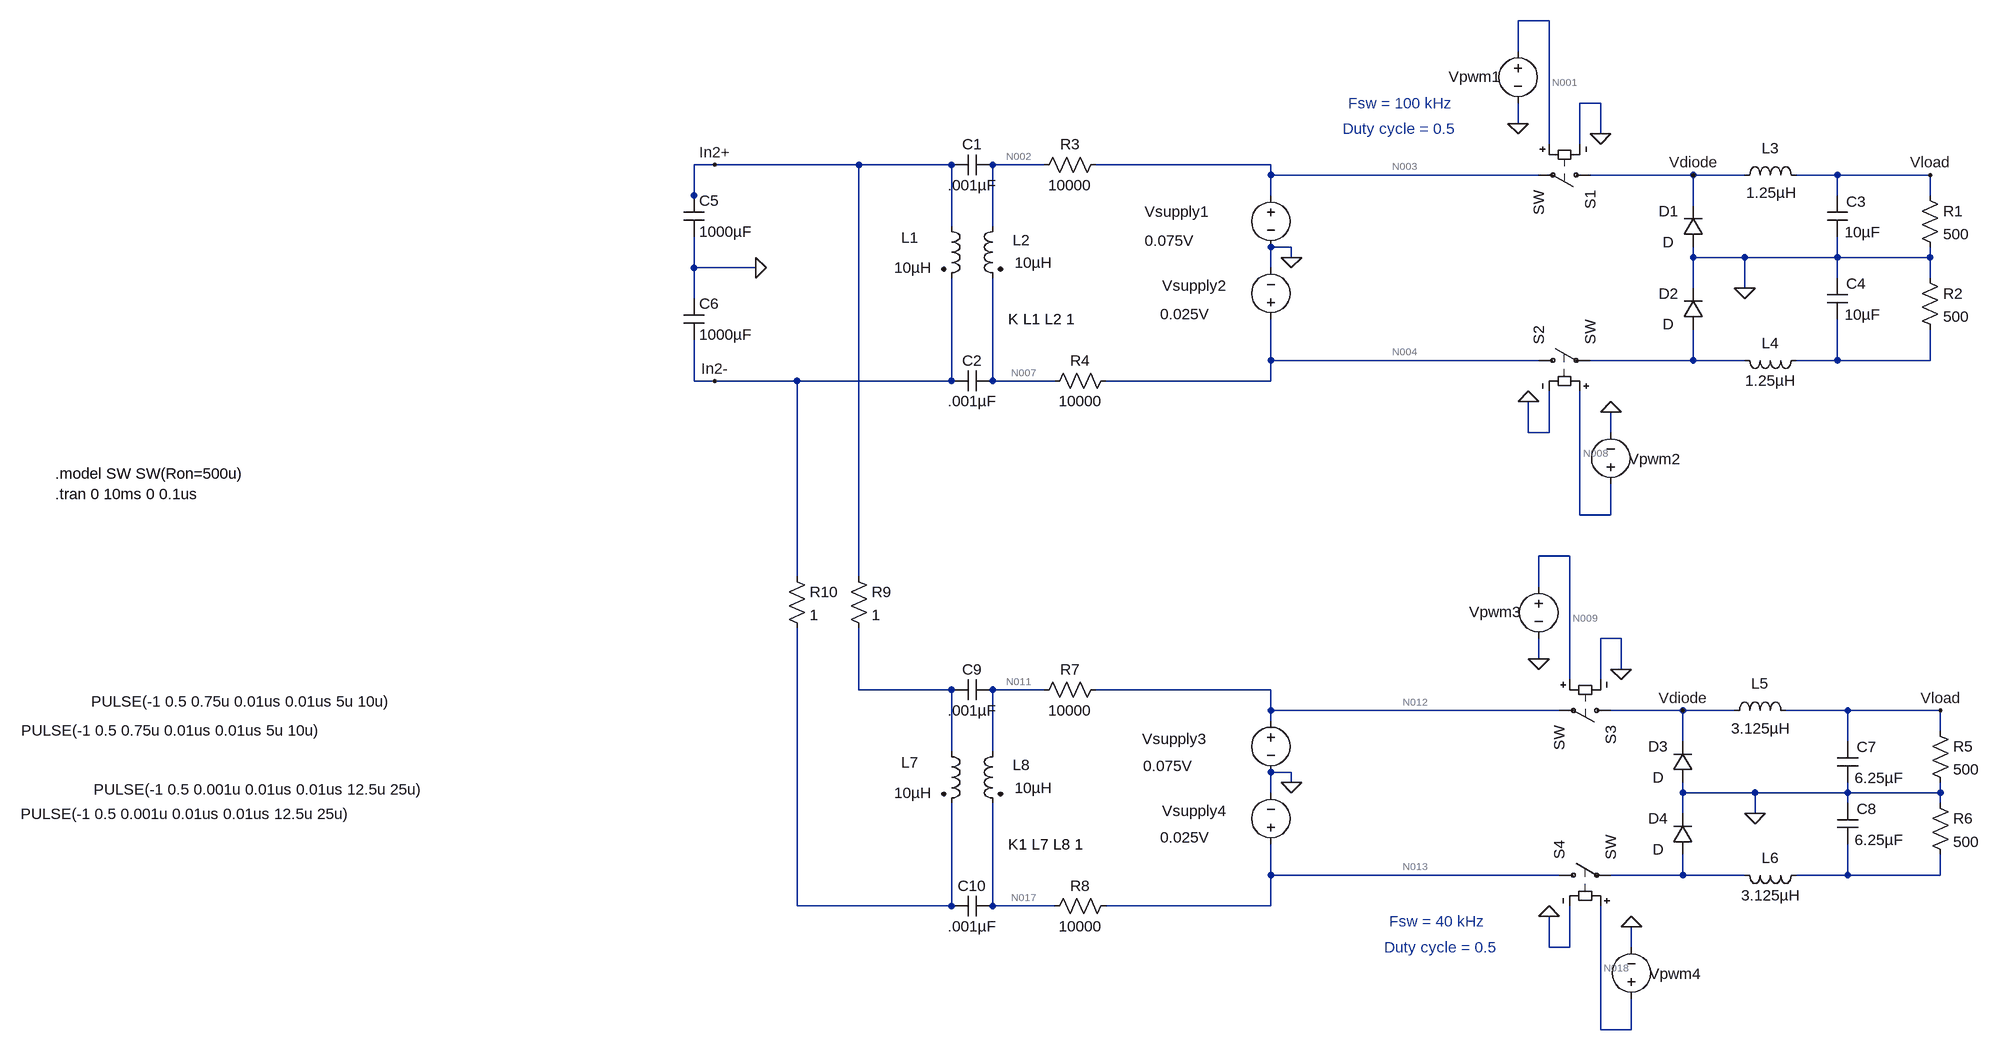
[diagram p0: schematic AC Power Flow ver2.3 (CM-DM Model) .asc]
AC Power Flow ver2.3 (CM-DM Model) .asc, the LTspice schematic file:
Version 4
SHEET 1 3264 1352
WIRE 1472 -320 1424 -320
WIRE 1424 -272 1424 -320
WIRE 1552 -192 1520 -192
WIRE 1424 -160 1424 -192
WIRE 1552 -144 1552 -192
WIRE 1472 -128 1472 -320
WIRE 1520 -128 1520 -192
WIRE 176 -96 144 -96
WIRE 400 -96 176 -96
WIRE 544 -96 400 -96
WIRE 688 -96 608 -96
WIRE 1040 -96 768 -96
WIRE 1040 -80 1040 -96
WIRE 1456 -80 1040 -80
WIRE 1696 -80 1536 -80
WIRE 1776 -80 1696 -80
WIRE 1920 -80 1856 -80
WIRE 2064 -80 1920 -80
WIRE 144 -48 144 -96
WIRE 1040 -48 1040 -80
WIRE 1920 -48 1920 -80
WIRE 2064 -48 2064 -80
WIRE 144 -32 144 -48
WIRE 1696 -32 1696 -80
WIRE 544 0 544 -96
WIRE 608 0 608 -96
WIRE 1072 32 1040 32
WIRE 1072 48 1072 32
WIRE 1696 48 1696 32
WIRE 1776 48 1696 48
WIRE 1920 48 1920 16
WIRE 1920 48 1776 48
WIRE 2064 48 2064 32
WIRE 2064 48 1920 48
WIRE 144 64 144 16
WIRE 240 64 144 64
WIRE 1040 64 1040 32
WIRE 1920 80 1920 48
WIRE 2064 80 2064 48
WIRE 1696 96 1696 48
WIRE 1776 96 1776 48
WIRE 144 112 144 64
WIRE 1040 208 1040 144
WIRE 1456 208 1040 208
WIRE 1696 208 1696 160
WIRE 1696 208 1536 208
WIRE 1776 208 1696 208
WIRE 1920 208 1920 144
WIRE 1920 208 1856 208
WIRE 2064 208 2064 160
WIRE 2064 208 1920 208
WIRE 144 240 144 176
WIRE 176 240 144 240
WIRE 304 240 176 240
WIRE 544 240 544 80
WIRE 544 240 304 240
WIRE 608 240 608 80
WIRE 704 240 608 240
WIRE 1040 240 1040 208
WIRE 1040 240 784 240
WIRE 1440 320 1440 272
WIRE 1472 320 1472 256
WIRE 1472 320 1440 320
WIRE 1568 320 1568 288
WIRE 1520 448 1520 256
WIRE 1568 448 1568 400
WIRE 1568 448 1520 448
WIRE 1504 512 1456 512
WIRE 304 544 304 240
WIRE 400 544 400 -96
WIRE 1456 560 1456 512
WIRE 1584 640 1552 640
WIRE 1456 672 1456 640
WIRE 1584 688 1584 640
WIRE 1504 704 1504 512
WIRE 1552 704 1552 640
WIRE 400 720 400 624
WIRE 544 720 400 720
WIRE 688 720 608 720
WIRE 1040 720 768 720
WIRE 1040 752 1040 720
WIRE 1488 752 1040 752
WIRE 1680 752 1568 752
WIRE 1760 752 1680 752
WIRE 1936 752 1840 752
WIRE 2080 752 1936 752
WIRE 1040 768 1040 752
WIRE 2080 784 2080 752
WIRE 1680 800 1680 752
WIRE 1936 800 1936 752
WIRE 544 816 544 720
WIRE 608 816 608 720
WIRE 1072 848 1040 848
WIRE 1072 864 1072 848
WIRE 1040 880 1040 848
WIRE 1680 880 1680 864
WIRE 1792 880 1680 880
WIRE 1936 880 1936 864
WIRE 1936 880 1792 880
WIRE 2080 880 2080 864
WIRE 2080 880 1936 880
WIRE 1936 896 1936 880
WIRE 2080 896 2080 880
WIRE 1680 912 1680 880
WIRE 1792 912 1792 880
WIRE 1040 1008 1040 960
WIRE 1488 1008 1040 1008
WIRE 1680 1008 1680 976
WIRE 1680 1008 1568 1008
WIRE 1776 1008 1680 1008
WIRE 1936 1008 1936 960
WIRE 1936 1008 1856 1008
WIRE 2080 1008 2080 976
WIRE 2080 1008 1936 1008
WIRE 304 1056 304 624
WIRE 544 1056 544 896
WIRE 544 1056 304 1056
WIRE 608 1056 608 896
WIRE 704 1056 608 1056
WIRE 1040 1056 1040 1008
WIRE 1040 1056 784 1056
WIRE 1472 1120 1472 1072
WIRE 1504 1120 1504 1056
WIRE 1504 1120 1472 1120
WIRE 1600 1120 1600 1088
WIRE 1552 1248 1552 1056
WIRE 1600 1248 1600 1200
WIRE 1600 1248 1552 1248
FLAG 240 64 0
FLAG 176 -96 In2+
FLAG 176 240 In2-
FLAG 1072 48 0
FLAG 1552 -144 0
FLAG 2064 -80 Vload
FLAG 1424 -160 0
FLAG 1696 -80 Vdiode
FLAG 1440 272 0
FLAG 1568 288 0
FLAG 1776 96 0
FLAG 1584 688 0
FLAG 2080 752 Vload
FLAG 1456 672 0
FLAG 1680 752 Vdiode
FLAG 1472 1072 0
FLAG 1600 1088 0
FLAG 1792 912 0
FLAG 1072 864 0
SYMBOL ind2 528 -16 R0
WINDOW 0 -62 33 Left 2
WINDOW 3 -73 80 Left 2
SYMATTR InstName L1
SYMATTR Value 10µH
SYMATTR Type ind
SYMBOL ind2 624 -16 M0
WINDOW 0 -42 37 Left 2
WINDOW 3 -76 72 Left 2
SYMATTR InstName L2
SYMATTR Value 10µH
SYMATTR Type ind
SYMBOL cap 608 -112 R90
WINDOW 0 0 32 VBottom 2
WINDOW 3 32 32 VTop 2
SYMATTR InstName C1
SYMATTR Value .001µF
SYMBOL cap 608 224 R90
WINDOW 0 0 32 VBottom 2
WINDOW 3 32 32 VTop 2
SYMATTR InstName C2
SYMATTR Value .001µF
SYMBOL sw 1552 -80 R90
SYMATTR InstName S1
SYMBOL voltage 1040 -64 R0
WINDOW 3 -196 86 Left 2
WINDOW 123 0 0 Left 2
WINDOW 39 0 0 Left 2
WINDOW 0 -196 41 Left 2
SYMATTR Value 0.075V
SYMATTR InstName Vsupply1
SYMBOL res 2048 -64 R0
SYMATTR InstName R1
SYMATTR Value 500
SYMBOL voltage 1424 -288 R0
WINDOW 3 -1752 1026 Right 2
WINDOW 123 0 0 Left 2
WINDOW 39 0 0 Left 2
WINDOW 0 -108 55 Left 2
SYMATTR Value PULSE(-1 0.5 0.75u 0.01us 0.01us 5u 10u)
SYMATTR InstName Vpwm1
SYMBOL diode 1712 32 R180
WINDOW 0 39 56 Left 2
WINDOW 3 46 8 Left 2
SYMATTR InstName D1
SYMBOL ind 1760 -64 R270
WINDOW 0 42 56 VTop 2
WINDOW 3 4 57 VBottom 2
SYMATTR InstName L3
SYMATTR Value 1.25µH
SYMBOL cap 1904 -48 R0
WINDOW 0 30 9 Left 2
WINDOW 3 27 57 Left 2
SYMATTR InstName C3
SYMATTR Value 10µF
SYMBOL voltage 1040 160 R180
WINDOW 3 95 24 Left 2
WINDOW 123 0 0 Left 2
WINDOW 39 0 0 Left 2
WINDOW 0 70 68 Left 2
SYMATTR Value 0.025V
SYMATTR InstName Vsupply2
SYMBOL ind 1872 192 R90
WINDOW 0 5 56 VBottom 2
WINDOW 3 32 56 VTop 2
SYMATTR InstName L4
SYMATTR Value 1.25µH
SYMBOL cap 1904 80 R0
WINDOW 0 30 9 Left 2
WINDOW 3 27 57 Left 2
SYMATTR InstName C4
SYMATTR Value 10µF
SYMBOL res 2048 64 R0
SYMATTR InstName R2
SYMATTR Value 500
SYMBOL diode 1712 160 R180
WINDOW 0 39 56 Left 2
WINDOW 3 46 8 Left 2
SYMATTR InstName D2
SYMBOL sw 1440 208 R270
SYMATTR InstName S2
SYMBOL voltage 1568 416 R180
WINDOW 3 2469 -367 Right 2
WINDOW 123 0 0 Left 2
WINDOW 39 0 0 Left 2
WINDOW 0 -108 55 Left 2
SYMATTR Value PULSE(-1 0.5 0.75u 0.01us 0.01us 5u 10u)
SYMATTR InstName Vpwm2
SYMBOL cap 128 -48 R0
SYMATTR InstName C5
SYMATTR Value 1000µF
SYMBOL cap 128 112 R0
SYMATTR InstName C6
SYMATTR Value 1000µF
SYMBOL res 672 -80 R270
WINDOW 0 32 56 VTop 2
WINDOW 3 0 56 VBottom 2
SYMATTR InstName R3
SYMATTR Value 10000
SYMBOL res 688 256 R270
WINDOW 0 32 56 VTop 2
WINDOW 3 0 56 VBottom 2
SYMATTR InstName R4
SYMATTR Value 10000
SYMBOL sw 1584 752 R90
SYMATTR InstName S3
SYMBOL res 2064 768 R0
SYMATTR InstName R5
SYMATTR Value 500
SYMBOL diode 1696 864 R180
WINDOW 0 39 56 Left 2
WINDOW 3 46 8 Left 2
SYMATTR InstName D3
SYMBOL ind 1744 768 R270
WINDOW 0 42 56 VTop 2
WINDOW 3 4 57 VBottom 2
SYMATTR InstName L5
SYMATTR Value 3.125µH
SYMBOL cap 1920 800 R0
WINDOW 0 30 9 Left 2
WINDOW 3 27 57 Left 2
SYMATTR InstName C7
SYMATTR Value 6.25µF
SYMBOL voltage 1456 544 R0
WINDOW 3 -1733 331 Right 2
WINDOW 123 0 0 Left 2
WINDOW 39 0 0 Left 2
WINDOW 0 -108 55 Left 2
SYMATTR Value PULSE(-1 0.5 0.001u 0.01us 0.01us 12.5u 25u)
SYMATTR InstName Vpwm3
SYMBOL ind 1872 992 R90
WINDOW 0 5 56 VBottom 2
WINDOW 3 32 56 VTop 2
SYMATTR InstName L6
SYMATTR Value 3.125µH
SYMBOL cap 1920 896 R0
WINDOW 0 30 9 Left 2
WINDOW 3 27 57 Left 2
SYMATTR InstName C8
SYMATTR Value 6.25µF
SYMBOL res 2064 880 R0
SYMATTR InstName R6
SYMATTR Value 500
SYMBOL diode 1696 976 R180
WINDOW 0 39 56 Left 2
WINDOW 3 46 8 Left 2
SYMATTR InstName D4
SYMBOL sw 1472 1008 R270
SYMATTR InstName S4
SYMBOL voltage 1600 1216 R180
WINDOW 3 2502 303 Right 2
WINDOW 123 0 0 Left 2
WINDOW 39 0 0 Left 2
WINDOW 0 -108 55 Left 2
SYMATTR Value PULSE(-1 0.5 0.001u 0.01us 0.01us 12.5u 25u)
SYMATTR InstName Vpwm4
SYMBOL ind2 528 800 R0
WINDOW 0 -62 33 Left 2
WINDOW 3 -73 80 Left 2
SYMATTR InstName L7
SYMATTR Value 10µH
SYMATTR Type ind
SYMBOL ind2 624 800 M0
WINDOW 0 -42 37 Left 2
WINDOW 3 -76 72 Left 2
SYMATTR InstName L8
SYMATTR Value 10µH
SYMATTR Type ind
SYMBOL cap 608 704 R90
WINDOW 0 0 32 VBottom 2
WINDOW 3 32 32 VTop 2
SYMATTR InstName C9
SYMATTR Value .001µF
SYMBOL cap 608 1040 R90
WINDOW 0 0 32 VBottom 2
WINDOW 3 32 32 VTop 2
SYMATTR InstName C10
SYMATTR Value .001µF
SYMBOL voltage 1040 752 R0
WINDOW 3 -198 86 Left 2
WINDOW 123 0 0 Left 2
WINDOW 39 0 0 Left 2
WINDOW 0 -200 44 Left 2
SYMATTR Value 0.075V
SYMATTR InstName Vsupply3
SYMBOL voltage 1040 976 R180
WINDOW 3 95 27 Left 2
WINDOW 123 0 0 Left 2
WINDOW 39 0 0 Left 2
WINDOW 0 70 68 Left 2
SYMATTR Value 0.025V
SYMATTR InstName Vsupply4
SYMBOL res 672 736 R270
WINDOW 0 32 56 VTop 2
WINDOW 3 0 56 VBottom 2
SYMATTR InstName R7
SYMATTR Value 10000
SYMBOL res 688 1072 R270
WINDOW 0 32 56 VTop 2
WINDOW 3 0 56 VBottom 2
SYMATTR InstName R8
SYMATTR Value 10000
SYMBOL res 384 528 R0
SYMATTR InstName R9
SYMATTR Value 1
SYMBOL res 288 528 R0
SYMATTR InstName R10
SYMATTR Value 1
TEXT 632 144 Left 2 !K L1 L2 1
TEXT -848 416 Left 2 !.tran 0 10ms 0 0.1us
TEXT -848 384 Left 2 !.model SW SW(Ron=500u)
TEXT 1160 -192 Left 2 ;Fsw = 100 kHz
TEXT 1152 -152 Left 2 ;Duty cycle = 0.5
TEXT 1224 1080 Left 2 ;Fsw = 40 kHz
TEXT 1216 1120 Left 2 ;Duty cycle = 0.5
TEXT 632 960 Left 2 !K1 L7 L8 1

The netlist it stands for:
* AC Power Flow ver2.3 (CM-DM Model) .asc
L1 In2+ In2- 10µH
L2 N002 N007 10µH
C1 N002 In2+ .001µF
C2 N007 In2- .001µF
S1 Vdiode N003 N001 0 SW
Vsupply1 N003 0 0.075V
R1 Vload 0 500
Vpwm1 N001 0 PULSE(-1 0.5 0.75u 0.01us 0.01us 5u 10u)
D1 0 Vdiode D
L3 Vdiode Vload 1.25µH
C3 Vload 0 10µF
Vsupply2 N004 0 0.025V
L4 N006 N005 1.25µH
C4 0 N006 10µF
R2 0 N006 500
D2 N005 0 D
S2 N004 N005 N008 0 SW
Vpwm2 N008 0 PULSE(-1 0.5 0.75u 0.01us 0.01us 5u 10u)
C5 In2+ 0 1000µF
C6 0 In2- 1000µF
R3 N002 N003 10000
R4 N007 N004 10000
S3 Vdiode N012 N009 0 SW
R5 Vload 0 500
D3 0 Vdiode D
L5 Vdiode Vload 3.125µH
C7 Vload 0 6.25µF
Vpwm3 N009 0 PULSE(-1 0.5 0.001u 0.01us 0.01us 12.5u 25u)
L6 N015 N014 3.125µH
C8 0 N015 6.25µF
R6 0 N015 500
D4 N014 0 D
S4 N013 N014 N018 0 SW
Vpwm4 N018 0 PULSE(-1 0.5 0.001u 0.01us 0.01us 12.5u 25u)
L7 N010 N016 10µH
L8 N011 N017 10µH
C9 N011 N010 .001µF
C10 N017 N016 .001µF
Vsupply3 N012 0 0.075V
Vsupply4 N013 0 0.025V
R7 N011 N012 10000
R8 N017 N013 10000
R9 In2+ N010 1
R10 In2- N016 1
.model D D
.lib standard.dio
K L1 L2 1
.tran 0 10ms 0 0.1us
.model SW SW(Ron=500u)
* Fsw = 100 kHz
* Duty cycle = 0.5
* Fsw = 40 kHz
* Duty cycle = 0.5
K1 L7 L8 1
.backanno
.end

* Results of the author's LTspice run, read from the files saved beside the schematic
* Operating Point, zero values left out:
*   V(n002) = 50 mV
*   V(n007) = 50 mV
*   V(n003) = 75 mV
*   V(n001) = -1 V
*   V(n004) = 25 mV
*   V(n008) = -1 V
*   V(n012) = 75 mV
*   V(n009) = -1 V
*   V(n013) = 25 mV
*   V(n018) = -1 V
*   V(n011) = 50 mV
*   V(n017) = 50 mV
*   I(L8) = 2.5 µA
*   I(L2) = 2.5 µA
*   I(R8) = 2.5 µA
*   I(R7) = -2.5 µA
*   I(R4) = 2.5 µA
*   I(R3) = -2.5 µA
*   I(Vsupply4) = 2.5 µA
*   I(Vsupply3) = -2.5 µA
*   I(Vsupply2) = 2.5 µA
*   I(Vsupply1) = -2.5 µA